# Altium project SCOM_2_IN_1_JLC_STACKUP.PrjPcb
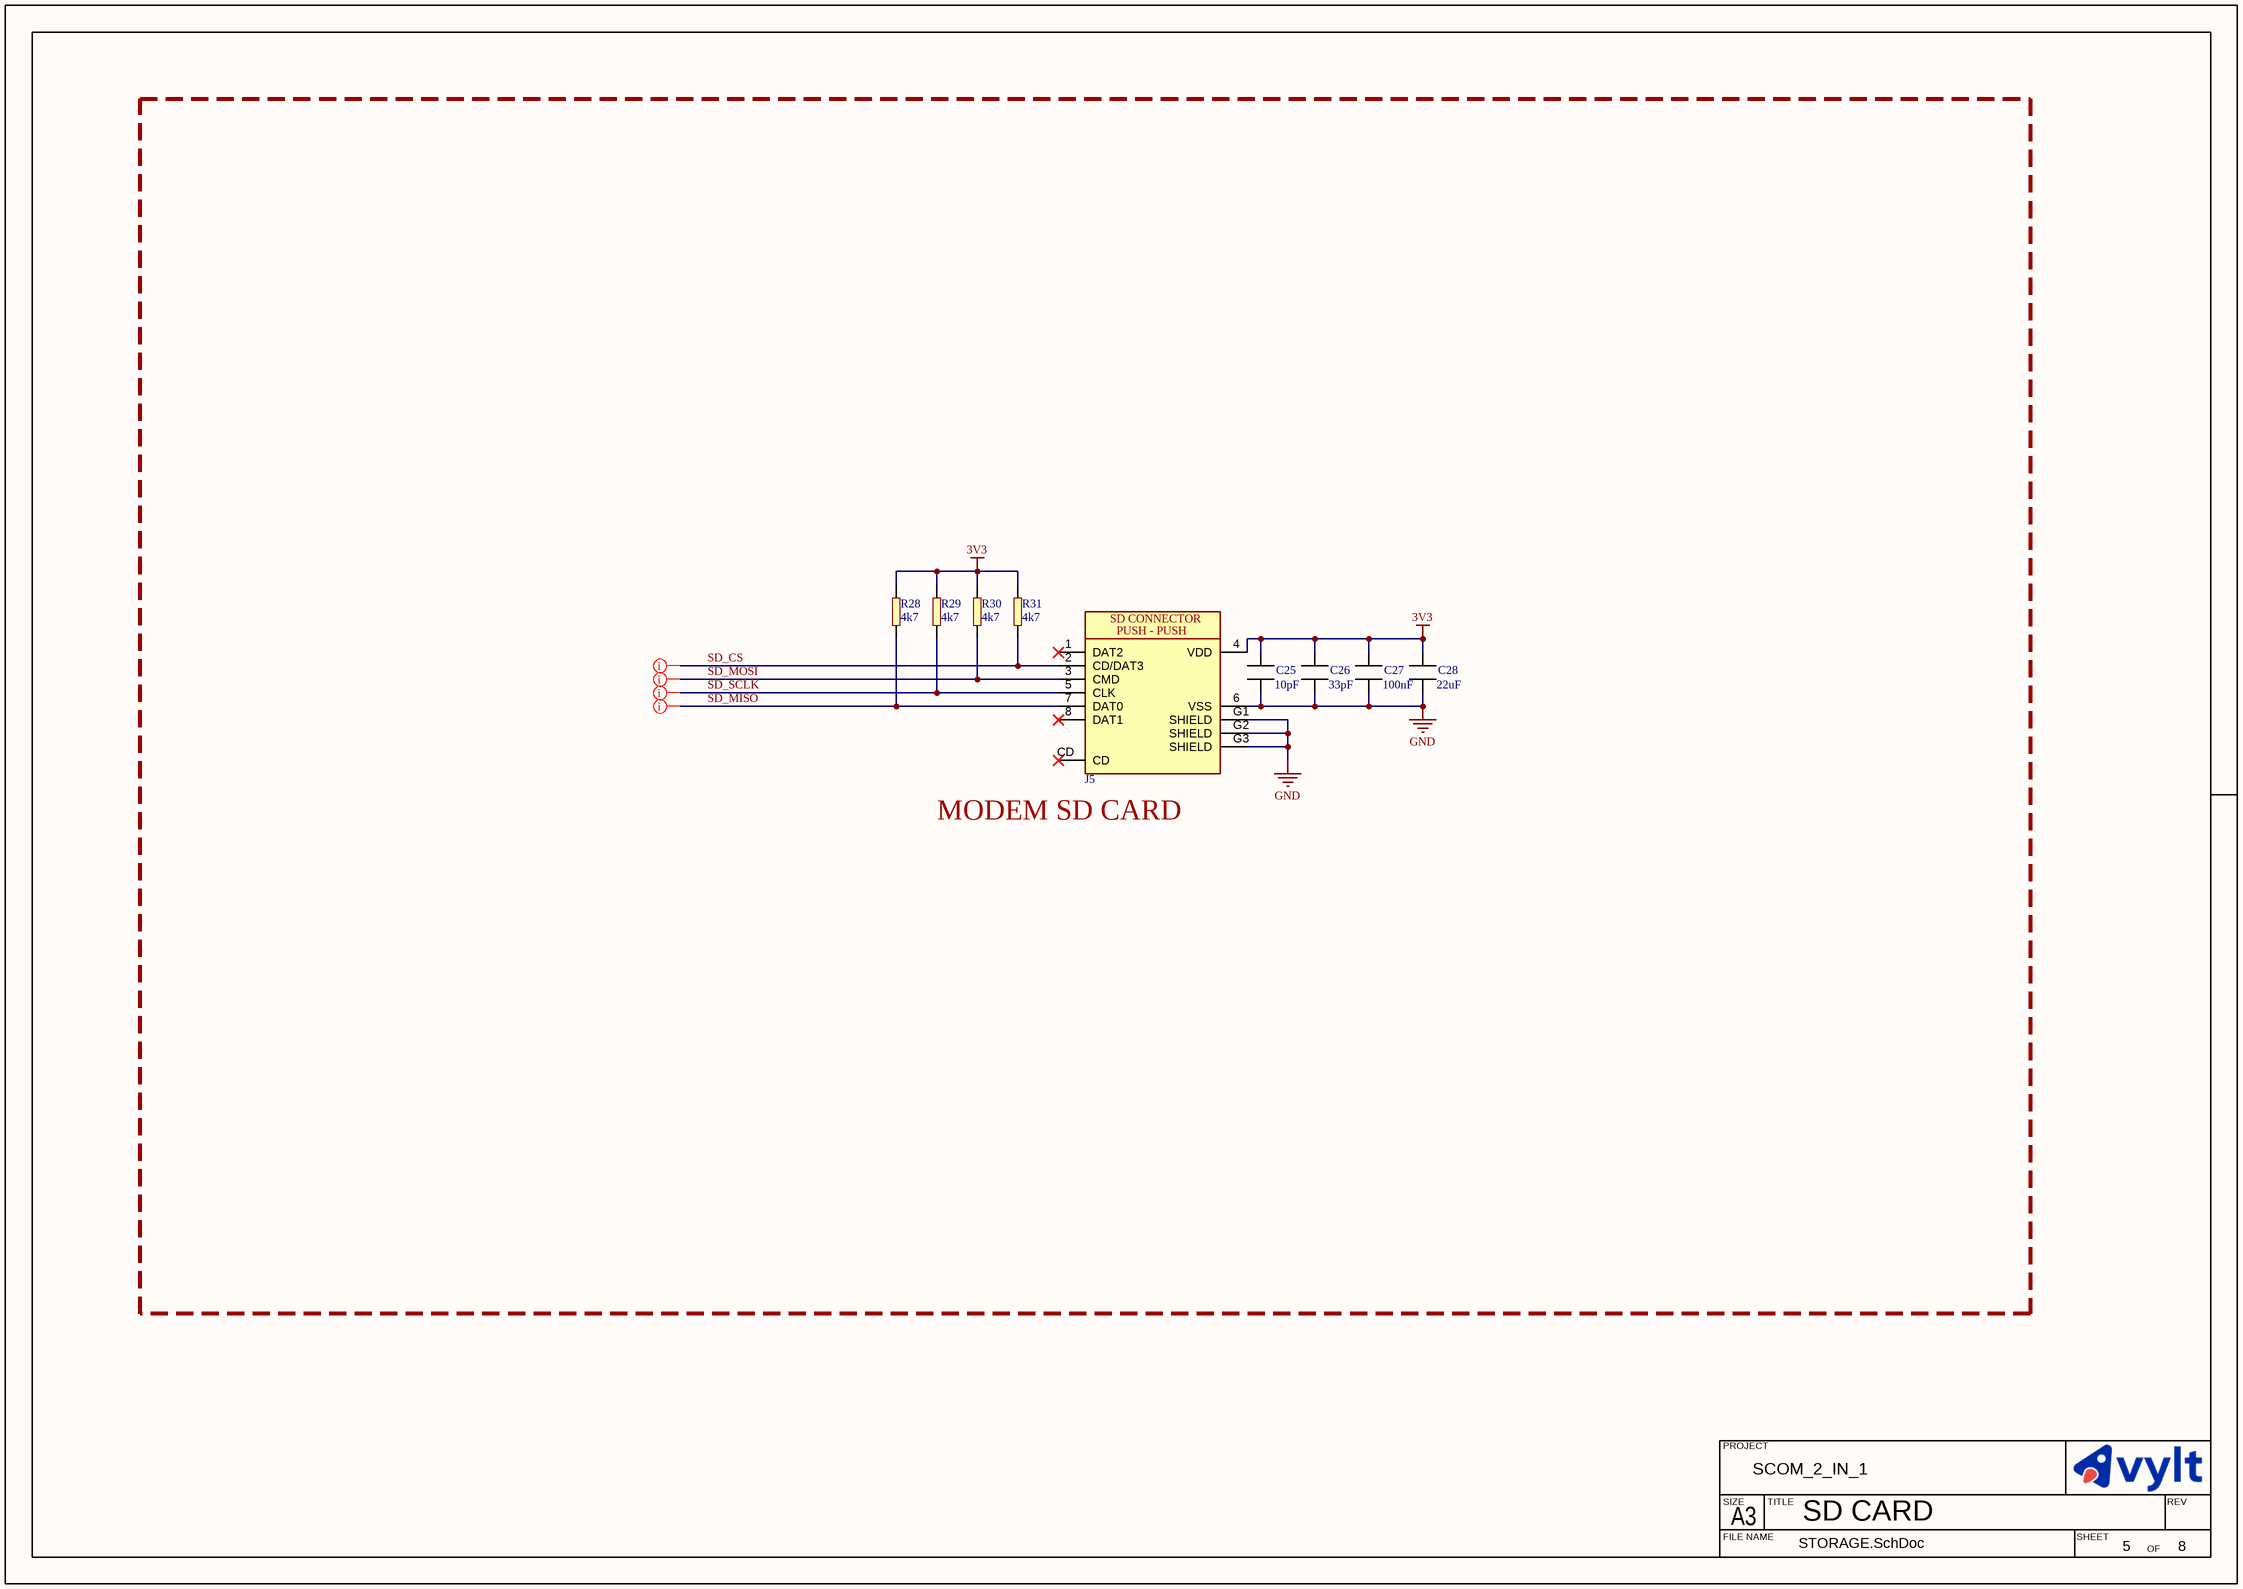
[diagram p0: STORAGE.SchDoc]
Project: SCOM_2_IN_1; Rev: 1.0; SheetTotal: 8
2 sheets, 45 parts. Net scope: global (net labels, ports and power ports of the same name join across sheets).
Board file: SCOM_2_IN_1_JLC_STACKUP.PcbDoc
Sheets:
  STORAGE.SchDoc
  MCU.SchDoc

## Sheet STORAGE.SchDoc: SD CARD
size 420 x 297 mm; Revision: 1.0; SheetNumber: 5

### Parts
C25  value 10pF  [CAPC2012X13L]  (hidden comment: MLCC_0805)
C26  value 33pF  [CAPC2012X13L]  (hidden comment: MLCC_0805)
C27  value 100nF  [CAPC2012X13L]  (hidden comment: MLCC_0805)
C28  value 22uF  [CAPC2012X13L]  (hidden comment: MLCC_0805)
J5  GTFP084  [GTFP084]  (value not drawn)
R28  value 4k7  [RES_0603]  (hidden comment: ERP_101-1)
R29  value 4k7  [RES_0603]  (hidden comment: ERP_101-1)
R30  value 4k7  [RES_0603]  (hidden comment: ERP_101-1)
R31  value 4k7  [RES_0603]  (hidden comment: ERP_101-1)

### Blocks framed on the sheet
MODEM SD CARD: C25-C28 J5 R28-R31

### Nets
3V3: C25.1 C26.1 C27.1 C28.1 J5.4(VDD) R28.2 R29.2 R30.2 R31.2
GND: C25.2 C26.2 C27.2 C28.2 J5.6(VSS) J5.G1(SHIELD) J5.G2(SHIELD) J5.G3(SHIELD)
SD_CS: J5.2(CD/DAT3) R31.1
SD_MISO: J5.7(DAT0) R28.1
SD_MOSI: J5.3(CMD) R30.1
SD_SCLK: J5.5(CLK) R29.1

Not connected (* = marked no-connect by the designer): J5 1(DAT2)* 8(DAT1)* CD*

### Layout directives
rule Width Constraint [Pref Impedance = 50.00ohms    Min Impedance = 50.00ohms    Max Impedance = 50.00ohms]: SD_CS, SD_MISO, SD_MOSI, SD_SCLK

### Notes on the sheet
- PROJECT
- SIZE
- FILE NAME
- A3
- TITLE
- SHEET
- OF
- REV
- (in symbol GTFP084) SD CONNECTOR; PUSH - PUSH

### Library data of the parts
C25-C28 = MLCC_0805: Chip Capacitor, 2-Leads, Body 2.00x1.25mm, IPC High Density; Package: 0805; Manufacturer 1: *; Manufacturer Part Number 1: *
J5 = GTFP084: 9 (8 + 1) Position Card Connector Secure Digital - microSD™ Surface Mount, Right Angle Gold; Manufacturer Part Number 1: GTFP08431BEU; Manufacturer 1: Amphenol; Package: 9 (8+1); Value: *; Supplier Part Number 1: 6172
R28-R31 = RES_0603: Package: 0603; Manufacturer 1: *; Manufacturer Part Number 1: *

## Sheet MCU.SchDoc: ESP32-PICO, STM32F4
size 420 x 297 mm; Revision: 1.0; SheetNumber: 6
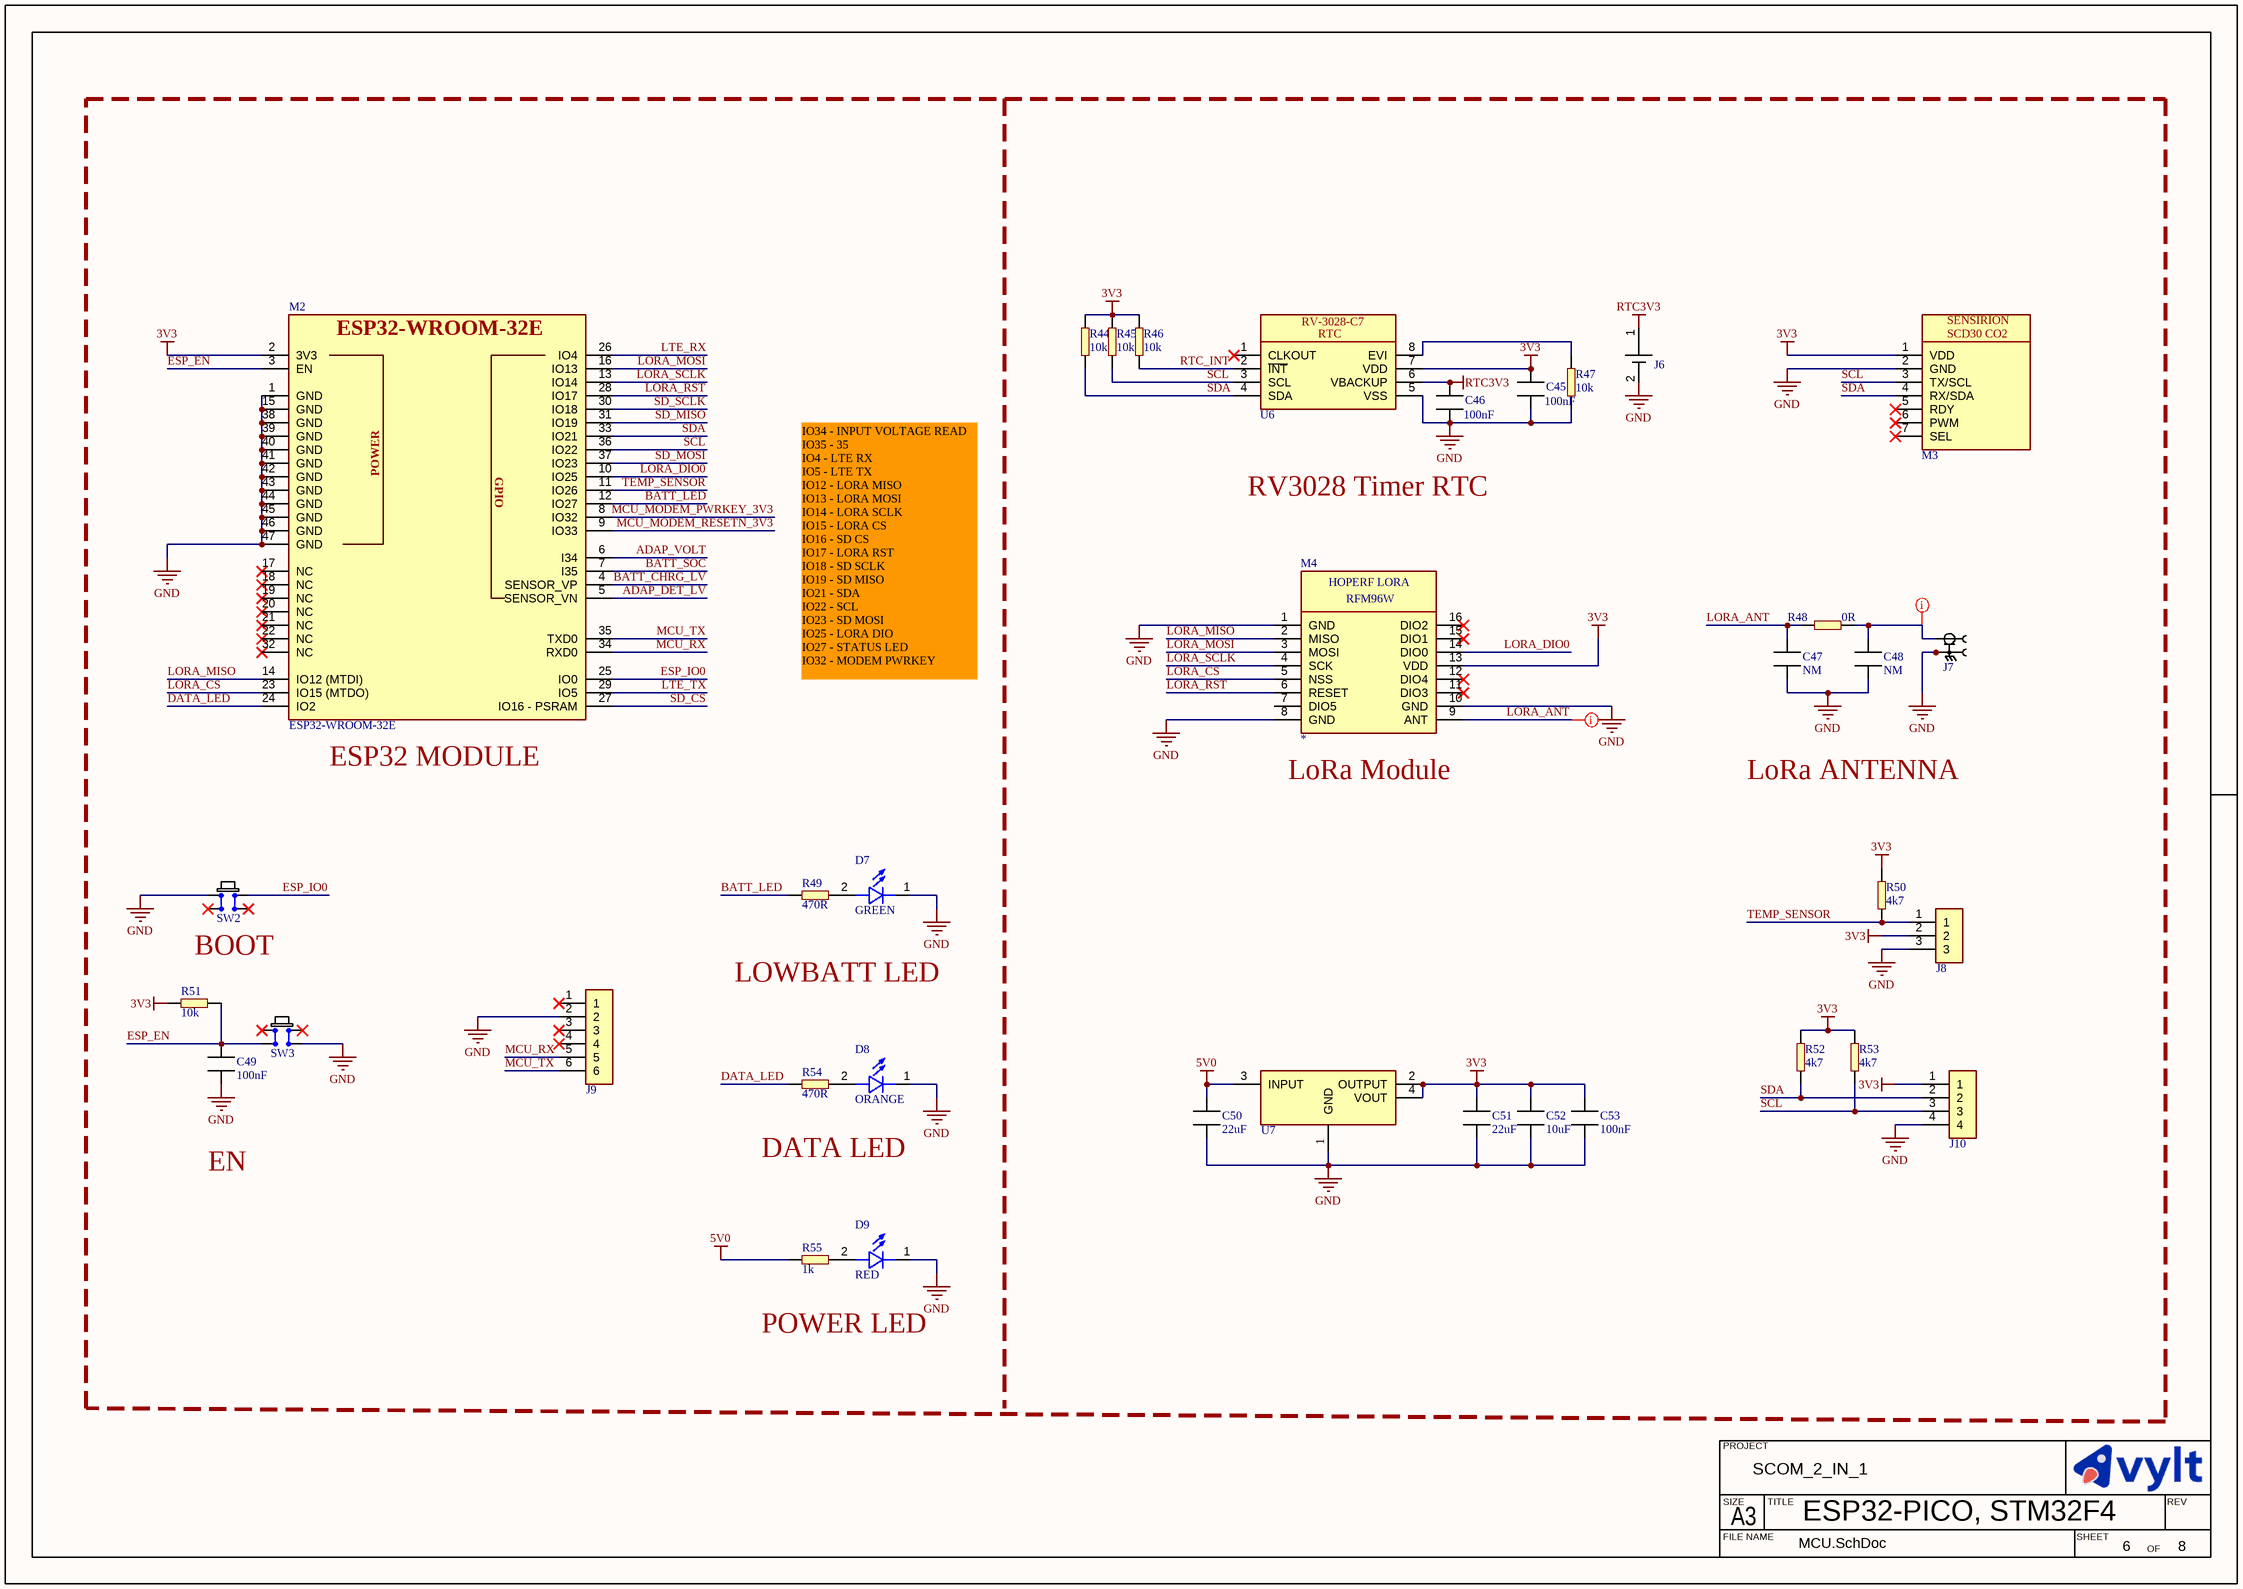
[diagram p1: MCU.SchDoc]

### Parts
C45  value 100nF  [CAPC2012X13L]  (hidden comment: MLCC_0805)
C46  value 100nF  [CAPC2012X13L]  (hidden comment: MLCC_0805)
C47  value NM  [CAPC0603X03L]  (hidden comment: ERP_102-1)  (no BOM)
C48  value NM  [CAPC0603X03L]  (hidden comment: ERP_102-1)  (no BOM)
C49  value 100nF  [CAPC2012X13L]  (hidden comment: MLCC_0805)
C50  value 22uF  [CAPC2012X13L]  (hidden comment: MLCC_0805)
C51  value 22uF  [CAPC2012X13L]  (hidden comment: MLCC_0805)
C52  value 10uF  [CAPC2012X13L]  (hidden comment: MLCC_0805)
C53  value 100nF  [CAPC2012X13L]  (hidden comment: MLCC_0805)
D7  value GREEN  [LED_1206]  (hidden comment: LED_1206)
D8  value ORANGE  [LED_1206]  (hidden comment: LED_1206)
D9  value RED  [LED_1206]  (hidden comment: LED_1206)
J6  CR1220-BH  [CR1220-BH]  (value not drawn)
J7  ERP_148-1  [uFL_50R]  (value not drawn)
J8  Terminal_Block_3Pin_5.08P  [TB_PLUG_5.08P_3P]  (value not drawn)
J9  ERP_148-2  [6PX1R_F]  (value not drawn)
J10  Terminal_Block_4Pin_5.08P  [TB_PLUG_5.08P_4P]  (value not drawn)
M2  ESP32-WROOM-32E  [ESP32-WROOM-32UE]
M3  SCD30  [SCD30]  (value not drawn)
M4  RFM96W  [RFM96W]  (value not drawn)
R44  value 10k  [RES_0603]  (hidden comment: ERP_101-1)
R45  value 10k  [RES_0603]  (hidden comment: ERP_101-1)
R46  value 10k  [RES_0603]  (hidden comment: ERP_101-1)
R47  value 10k  [RES_0603]  (hidden comment: ERP_101-1)
R48  value 0R  [RESC0603X03L]  (hidden comment: ERP_101-1)
R49  value 470R  [RES_0603]  (hidden comment: ERP_101-1)
R50  value 4k7  [RES_0603]  (hidden comment: ERP_101-1)
R51  value 10k  [RES_0603]  (hidden comment: ERP_101-1)
R52  value 4k7  [RES_0603]  (hidden comment: ERP_101-1)
R53  value 4k7  [RES_0603]  (hidden comment: ERP_101-1)
R54  value 470R  [RES_0603]  (hidden comment: ERP_101-1)
R55  value 1k  [RES_0603]  (hidden comment: ERP_101-1)
SW2  Generic6X6  [Generic6X6]  (value not drawn)
SW3  Generic6X6  [Generic6X6]  (value not drawn)
U6  RV-3028-C7  [RV-3028-C7]  (value not drawn)
U7  ERP_123-1  [AMS1117_SOT223]  (value not drawn)

### Nets
3V3: C45.1 C51.1 C52.1 C53.1 J8.2 J10.1 M2.2(3V3) M3.1(VDD) M4.13(VDD) R44.2 R45.2 R46.2 R50.1 R51.2 R52.1 R53.1 U6.7(VDD) U7.2(OUTPUT) U7.4(VOUT)
5V0: C50.1 R55.2 U7.3(INPUT)
GND: C45.2 C46.2 C47.1 C48.1 C49.2 C50.2 C51.2 C52.2 C53.2 D7.1 D8.1 D9.1 J6.2(-) J7.1 J7.2 J8.3 J9.2 J10.4 M2.1(GND) M2.15(GND) M2.38(GND) M2.39(GND) M2.40(GND) M2.41(GND) M2.42(GND) M2.43(GND) M2.44(GND) M2.45(GND) M2.46(GND) M2.47(GND) M3.2(GND) M4.1(GND) M4.8(GND) M4.10(GND) R47.1 SW2.1(NO) SW3.4(COM) U6.5(VSS) U7.1(GND)
RTC3V3: C46.1 J6.1(+) U6.6(VBACKUP)
ADAP_DET_LV: M2.5(SENSOR_VN)
ADAP_VOLT: M2.6(I34)
BATT_CHRG_LV: M2.4(SENSOR_VP)
BATT_LED: M2.12(IO27) R49.2
BATT_SOC: M2.7(I35)
DATA_LED: M2.24(IO2) R54.2
ESP_EN: C49.1 M2.3(EN) R51.1 SW3.2(NO)
ESP_IO0: M2.25(IO0) SW2.3(COM)
LORA_ANT: C47.2 M4.9(ANT) R48.2
LORA_CS: M2.23(IO15_(MTDO)) M4.5(NSS)
LORA_DIO0: M2.10(IO25) M4.14(DIO0)
LORA_MISO: M2.14(IO12_(MTDI)) M4.2(MISO)
LORA_MOSI: M2.16(IO13) M4.3(MOSI)
LORA_RST: M2.28(IO17) M4.6(RESET)
LORA_SCLK: M2.13(IO14) M4.4(SCK)
LTE_RX: M2.26(IO4)
LTE_TX: M2.29(IO5)
MCU_MODEM_PWRKEY_3V3: M2.8(IO32)
MCU_MODEM_RESETN_3V3: M2.9(IO33)
MCU_RX: J9.5 M2.34(RXD0)
MCU_TX: J9.6 M2.35(TXD0)
RTC_INT: R46.1 U6.2(~{INT})
SCL: J10.3 M2.36(IO22) M3.3(TX/SCL) R45.1 R53.2 U6.3(SCL)
SD_CS: M2.27(IO16_-_PSRAM)
SD_MISO: M2.31(IO19)
SD_MOSI: M2.37(IO23)
SD_SCLK: M2.30(IO18)
SDA: J10.2 M2.33(IO21) M3.4(RX/SDA) R44.1 R52.2 U6.4(SDA)
TEMP_SENSOR: J8.1 M2.11(IO26) R50.2
NetC48_2: C48.2 J7.3 R48.1
NetD7_2: D7.2 R49.1
NetD8_2: D8.2 R54.1
NetD9_2: D9.2 R55.1
NetR47_2: R47.2 U6.8(EVI)

Not connected (* = marked no-connect by the designer): J9 1* 3* 4*; M2 17(NC)* 18(NC)* 19(NC)* 20(NC)* 21(NC)* 22(NC)* 32(NC)*; M3 5(RDY)* 6(PWM)* 7(SEL)*; M4 7(DIO5) 11(DIO3)* 12(DIO4)* 15(DIO1)* 16(DIO2)*; SW2 2(NO)* 4(COM)*; SW3 1(NO)* 3(COM)*; U6 1(CLKOUT)*

### Layout directives
net class ANT_50R; rule Width Constraint [Pref Impedance = 50.00ohms    Min Impedance = 50.00ohms    Max Impedance = 50.00ohms]: LORA_ANT, NetC48_2

### Notes on the sheet
- RV3028 Timer RTC
- IO34 - INPUT VOLTAGE READ
  IO35 - 35
  IO4 - LTE RX
  IO5 - LTE TX
  IO12 - LORA MISO
  IO13 - LORA MOSI
  IO14 - LORA SCLK
  IO15 - LORA CS
  IO16 - SD CS
  IO17 - LORA RST
  IO18 - SD SCLK
  IO19 - SD MISO
  IO21 - SDA
  IO22 - SCL
  IO23 - SD MOSI
  IO25 - LORA DIO
  IO27 - STATUS LED
  IO32 - MODEM PWRKEY
- (near M2) ESP32 MODULE
- (near M4) LoRa Module
- LoRa ANTENNA
- (near SW2) BOOT
- LOWBATT LED
- EN
- DATA LED
- POWER LED
- PROJECT
- SIZE
- FILE NAME
- A3
- TITLE
- SHEET
- OF
- REV
- (in symbol ESP32-WROOM-32E) POWER; GPIO
- (in symbol RFM96W) HOPERF LORA
- (in symbol RV-3028-C7) RTC
- (in symbol SCD30) SENSIRION; SCD30 CO2

### Library data of the parts
C45 C46 = MLCC_0805: 1uF 105 0805 (2012 metric) 50V X7R MLCC SMD; Package: 0805; Manufacturer 1: *; Manufacturer Part Number 1: *
C47 C48 = MLCC_0201: Chip Capacitor, 2-Leads, Body 0.60x0.30mm, IPC High Density; Package: 0201; Manufacturer 1: *; Manufacturer Part Number 1: *
C49-C53 = MLCC_0805: as C25 on sheet STORAGE; Package: 0805; Manufacturer 1: *; Manufacturer Part Number 1: *
D7-D9 = LED_1206: LED CLEAR 1206 SMD; Manufacturer Part Number 1: 6395; Manufacturer 1: Sunrom
J6 = CR1220-BH: BATTERY HOLDER COIN 12.5MM SMD; Manufacturer 1: Keystone Electronics; Value: *; Manufacturer Part Number 1: *
J7 = uFL_50R: Package: L3W3; Value: *; ERP: *; Manufacturer 1: *; Manufacturer Part Number 1: *; Supplier 1: *; Suuplier Part Number 1: *
J8 = Terminal_Block_3Pin_5.08P: 3PINS TERMINAL BLOCK 5.08 PITCH; Manufacturer Part Number 1: *; Manufacturer 1: *; Supplier Part Number 1: *; Supplier 1: *; ERP: *; Package: 6PIN
J9 = 6PX1R_F: 6PX1R Female Header; Value: *; Manufacturer 1: *; Manufacturer Part Number 1: *
J10 = Terminal_Block_4Pin_5.08P: 4PINS TERMINAL BLOCK 5.08 PITCH; Manufacturer Part Number 1: *; Manufacturer 1: *; Supplier Part Number 1: *; Supplier 1: *; ERP: *; Package: 6PIN
M2 = ESP32-WROOM-32E: ESP32-WROOM-32E Module; Manufacturer 1: Espressif Systems; Manufacturer Part Number 1: *; Package: *; Value: ESP32-WROOM-32E
M3 = SCD30: CO₂ accuracy of ±(30 ppm + 3% MV) @400-10000 ppm; Manufacturer 1: *; Manufacturer Part Number 1: SCD30; Supplier 1: *; Supplier Part Number 1: *; ERP: *; Package: SOT-353
M4 = RFM96W: LoRa 868MHz SX1276 RF Transreceiver Module RFM96W; Manufacturer 1: *; Manufacturer Part Number 1: *; Value: *
R44-R47 R49-R55 = RES_0603: Package: 0603; Manufacturer 1: *; Manufacturer Part Number 1: *
  R44-R47: Supplier 1: *; Supplier Part Number 1: *; ERP: *
  R49 R50 R52-R55: ERP: *
R48 = RES_0201: Package: 0201; Manufacturer 1: *; Manufacturer Part Number 1: *
SW2 SW3 = Generic6X6: Tactile Switch SPST-NO Top Actuated Surface Mount; Manufacturer 1: C&K; Manufacturer Part Number 1: *; Package: 4.5X4.5
U6 = RV-3028-C7: IC RTC CLK/CALENDAR I2C 8SON; Manufacturer 1: Micro Crystal AG; Manufacturer Part Number 1: RV-3028-C7 32.768KHZ 1PPM-TA-QC; Value: *
U7 = AMS1117_SOT223: AMS1117 LDO; Manufacturer 1: TI; Supplier  Part Number 1: *; Supplier  1: *; Package: SOT223; Manufacturer Part Number 1: *

## Nets that join several sheets
3V3: STORAGE (9 pins), MCU (19 pins)
GND: STORAGE (8 pins), MCU (39 pins)
SD_CS: STORAGE (J5.2 R31.1), MCU (M2.27)
SD_MISO: STORAGE (J5.7 R28.1), MCU (M2.31)
SD_MOSI: STORAGE (J5.3 R30.1), MCU (M2.37)
SD_SCLK: STORAGE (J5.5 R29.1), MCU (M2.30)